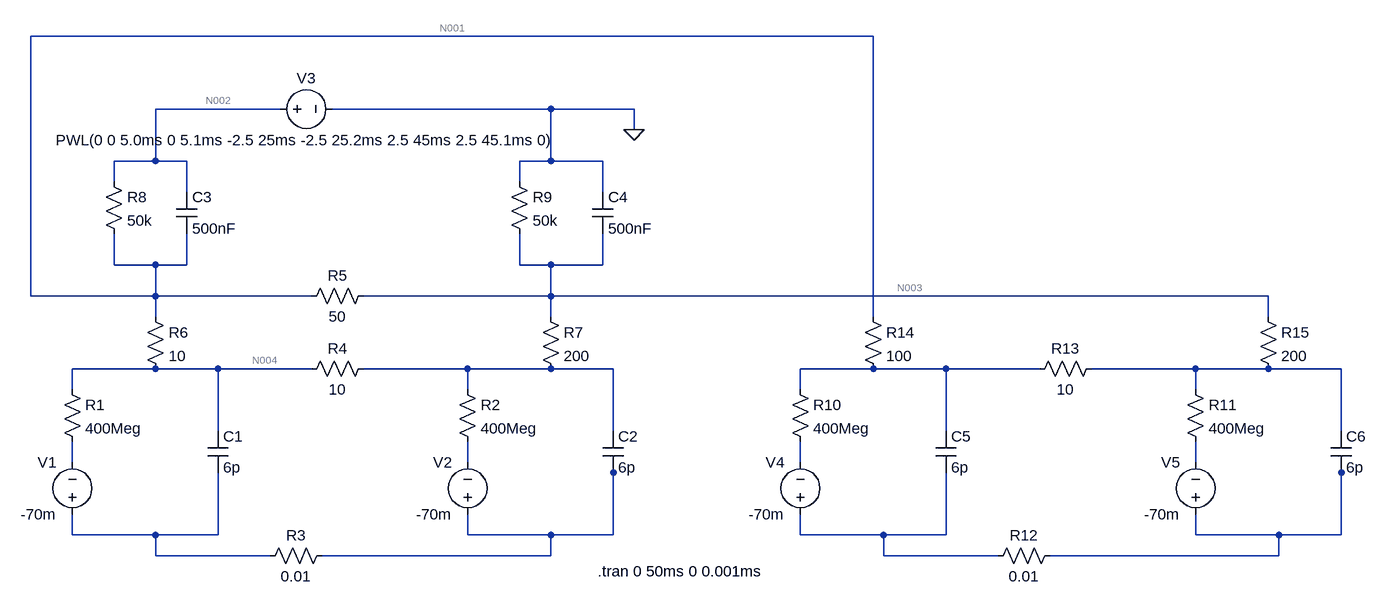
[diagram p0: schematic 電圧刺激等価回路_論文用_20210119_2.asc]
電圧刺激等価回路_論文用_20210119_2.asc, the LTspice schematic file:
Version 4
SHEET 1 1992 680
WIRE 1232 -480 -64 -480
WIRE 320 -368 128 -368
WIRE 736 -368 400 -368
WIRE 864 -368 736 -368
WIRE 864 -336 864 -368
WIRE 128 -288 128 -368
WIRE 128 -288 64 -288
WIRE 176 -288 128 -288
WIRE 736 -288 736 -368
WIRE 736 -288 688 -288
WIRE 816 -288 736 -288
WIRE 64 -256 64 -288
WIRE 688 -256 688 -288
WIRE 176 -240 176 -288
WIRE 816 -240 816 -288
WIRE 64 -128 64 -176
WIRE 128 -128 64 -128
WIRE 176 -128 176 -176
WIRE 176 -128 128 -128
WIRE 688 -128 688 -176
WIRE 736 -128 688 -128
WIRE 816 -128 816 -176
WIRE 816 -128 736 -128
WIRE -64 -80 -64 -480
WIRE 128 -80 128 -128
WIRE 128 -80 -64 -80
WIRE 368 -80 128 -80
WIRE 736 -80 736 -128
WIRE 736 -80 448 -80
WIRE 1840 -80 736 -80
WIRE 128 -48 128 -80
WIRE 736 -48 736 -80
WIRE 1232 -48 1232 -480
WIRE 1840 -48 1840 -80
WIRE 128 32 0 32
WIRE 224 32 128 32
WIRE 368 32 224 32
WIRE 608 32 448 32
WIRE 736 32 608 32
WIRE 832 32 736 32
WIRE 1232 32 1120 32
WIRE 1344 32 1232 32
WIRE 1488 32 1344 32
WIRE 1728 32 1568 32
WIRE 1840 32 1728 32
WIRE 1952 32 1840 32
WIRE 0 64 0 32
WIRE 608 64 608 32
WIRE 1120 64 1120 32
WIRE 1728 64 1728 32
WIRE 224 128 224 32
WIRE 832 128 832 32
WIRE 1344 128 1344 32
WIRE 1952 128 1952 32
WIRE 0 176 0 144
WIRE 608 176 608 144
WIRE 1120 176 1120 144
WIRE 1728 176 1728 144
WIRE 832 192 832 176
WIRE 1952 192 1952 176
WIRE 0 288 0 256
WIRE 128 288 0 288
WIRE 224 288 224 192
WIRE 224 288 128 288
WIRE 608 288 608 256
WIRE 736 288 608 288
WIRE 832 288 832 192
WIRE 832 288 736 288
WIRE 1120 288 1120 256
WIRE 1248 288 1120 288
WIRE 1344 288 1344 192
WIRE 1344 288 1248 288
WIRE 1728 288 1728 256
WIRE 1856 288 1728 288
WIRE 1952 288 1952 192
WIRE 1952 288 1856 288
WIRE 128 320 128 288
WIRE 304 320 128 320
WIRE 736 320 736 288
WIRE 736 320 384 320
WIRE 1248 320 1248 288
WIRE 1424 320 1248 320
WIRE 1856 320 1856 288
WIRE 1856 320 1504 320
FLAG 864 -336 0
SYMBOL voltage 304 -368 R270
WINDOW 0 32 56 VTop 2
WINDOW 3 -32 56 VBottom 2
WINDOW 123 0 0 Left 0
WINDOW 39 0 0 Left 0
SYMATTR InstName V3
SYMATTR Value PWL(0 0 5.0ms 0 5.1ms -2.5 25ms -2.5 25.2ms 2.5 45ms 2.5 45.1ms 0)
SYMBOL res -16 48 R0
SYMATTR InstName R1
SYMATTR Value 400Meg
SYMBOL res 592 48 R0
SYMATTR InstName R2
SYMATTR Value 400Meg
SYMBOL res 400 304 R90
WINDOW 0 0 56 VBottom 2
WINDOW 3 32 56 VTop 2
SYMATTR InstName R3
SYMATTR Value 0.01
SYMBOL res 112 -64 R0
SYMATTR InstName R6
SYMATTR Value 10
SYMBOL res 720 -64 R0
SYMATTR InstName R7
SYMATTR Value 200
SYMBOL cap 208 128 R0
SYMATTR InstName C1
SYMATTR Value 6p
SYMBOL cap 816 128 R0
SYMATTR InstName C2
SYMATTR Value 6p
SYMBOL cap 160 -240 R0
SYMATTR InstName C3
SYMATTR Value 500nF
SYMBOL cap 800 -240 R0
SYMATTR InstName C4
SYMATTR Value 500nF
SYMBOL res 48 -272 R0
SYMATTR InstName R8
SYMATTR Value 50k
SYMBOL res 672 -272 R0
SYMATTR InstName R9
SYMATTR Value 50k
SYMBOL voltage 0 272 R180
WINDOW 0 24 96 Left 2
WINDOW 3 24 16 Left 2
SYMATTR InstName V1
SYMATTR Value -70m
SYMBOL voltage 608 272 R180
WINDOW 0 24 96 Left 2
WINDOW 3 24 16 Left 2
SYMATTR InstName V2
SYMATTR Value -70m
SYMBOL res 464 16 R90
WINDOW 0 0 56 VBottom 2
WINDOW 3 32 56 VTop 2
SYMATTR InstName R4
SYMATTR Value 10
SYMBOL res 464 -96 R90
WINDOW 0 0 56 VBottom 2
WINDOW 3 32 56 VTop 2
SYMATTR InstName R5
SYMATTR Value 50
SYMBOL res 1104 48 R0
SYMATTR InstName R10
SYMATTR Value 400Meg
SYMBOL res 1712 48 R0
SYMATTR InstName R11
SYMATTR Value 400Meg
SYMBOL res 1520 304 R90
WINDOW 0 0 56 VBottom 2
WINDOW 3 32 56 VTop 2
SYMATTR InstName R12
SYMATTR Value 0.01
SYMBOL cap 1328 128 R0
SYMATTR InstName C5
SYMATTR Value 6p
SYMBOL cap 1936 128 R0
SYMATTR InstName C6
SYMATTR Value 6p
SYMBOL voltage 1120 272 R180
WINDOW 0 24 96 Left 2
WINDOW 3 24 16 Left 2
SYMATTR InstName V4
SYMATTR Value -70m
SYMBOL voltage 1728 272 R180
WINDOW 0 24 96 Left 2
WINDOW 3 24 16 Left 2
SYMATTR InstName V5
SYMATTR Value -70m
SYMBOL res 1584 16 R90
WINDOW 0 0 56 VBottom 2
WINDOW 3 32 56 VTop 2
SYMATTR InstName R13
SYMATTR Value 10
SYMBOL res 1216 -64 R0
SYMATTR InstName R14
SYMATTR Value 100
SYMBOL res 1824 -64 R0
SYMATTR InstName R15
SYMATTR Value 200
TEXT 808 344 Left 2 !.tran 0 50ms 0 0.001ms

The netlist it stands for:
* 電圧刺激等価回路_論文用_20210119_2.asc
V3 N002 0 PWL(0 0 5.0ms 0 5.1ms -2.5 25ms -2.5 25.2ms 2.5 45ms 2.5 45.1ms 0)
R1 N004 N008 400Meg
R2 N005 N009 400Meg
R3 N012 N014 0.01
R6 N001 N004 10
R7 N003 N005 200
C1 N004 N014 6p
C2 N005 N012 6p
C3 N002 N001 500nF
C4 0 N003 500nF
R8 N002 N001 50k
R9 0 N003 50k
V1 N014 N008 -70m
V2 N012 N009 -70m
R4 N005 N004 10
R5 N003 N001 50
R10 N006 N010 400Meg
R11 N007 N011 400Meg
R12 N013 N015 0.01
C5 N006 N015 6p
C6 N007 N013 6p
V4 N015 N010 -70m
V5 N013 N011 -70m
R13 N007 N006 10
R14 N001 N006 100
R15 N003 N007 200
.tran 0 50ms 0 0.001ms
.backanno
.end

* Results of the author's LTspice run, read from the files saved beside the schematic
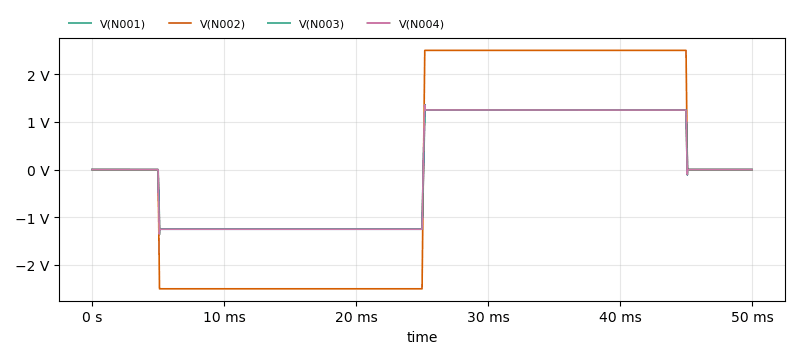
[diagram p1: Transient Analysis of 電圧刺激等価回路_論文用_20210119_2.asc, plotted from the saved traces]
* Transient Analysis, 1 run:
*   V(N001): min -1.363 V, max 1.363 V, average -2.501 mV, rms 1.117 V, last 0 V
*   V(N002): min -2.5 V, max 2.5 V, average -5 mV, rms 2.232 V, last 0 V
*   V(N003): min -1.25 V, max 1.25 V, average -2.499 mV, rms 1.116 V, last 0 V
*   V(N004): min -1.353 V, max 1.353 V, average -2.501 mV, rms 1.117 V, last 0 V